# EAGLE schematic michibot (EAGLE 9.6.2)
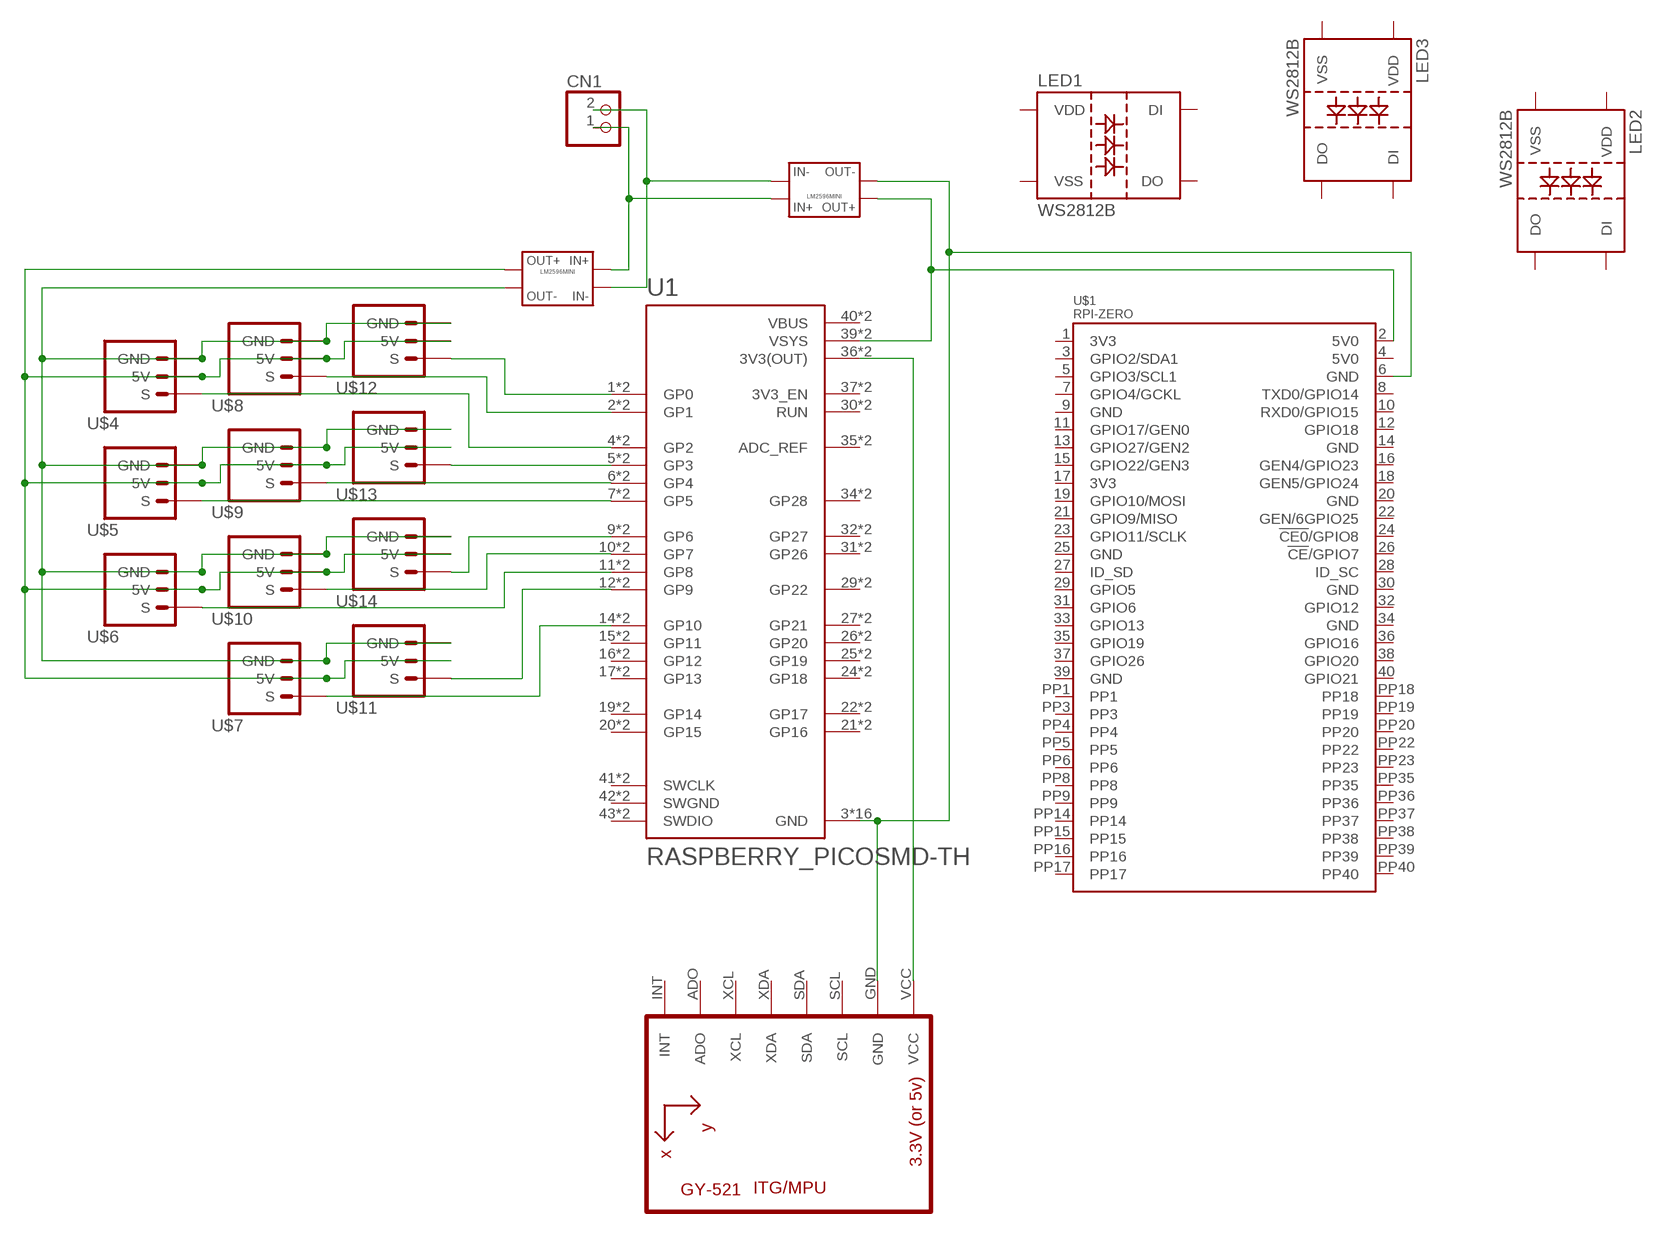
[diagram p0: schematic, sheet 1]

## Parts
CN1  JST_2PIN-THM  [JST-PH-2-THM]
LED1  WS2812B  [WS2812B]
LED2  WS2812B  [WS2812B]
LED3  WS2812B  [WS2812B]
U1  RASPBERRY_PICOSMD-TH  [PICO-PKG]
U2  GY-521MPU6050  [GY-521]
U$1  RPI-ZERO  [RASP_PI_ZERO_BOARD_FULL]
U$2  BB-LM2596MINI  [BB-LM2596MINI]
U$3  BB-LM2596MINI  [BB-LM2596MINI]
U$4  BB-PIN3  [BB-PIN3]
U$5  BB-PIN3  [BB-PIN3]
U$6  BB-PIN3  [BB-PIN3]
U$7  BB-PIN3  [BB-PIN3]
U$8  BB-PIN3  [BB-PIN3]
U$9  BB-PIN3  [BB-PIN3]
U$10  BB-PIN3  [BB-PIN3]
U$11  BB-PIN3  [BB-PIN3]
U$12  BB-PIN3  [BB-PIN3]
U$13  BB-PIN3  [BB-PIN3]
U$14  BB-PIN3  [BB-PIN3]

## Nets
5V0@1: U1.39(VSYS) U1.P$39(VSYS) U$1.2(5V0) U$2.OUT+
GND@8: U1.3(GND) U1.8(GND) U1.13(GND) U1.18(GND) U1.23(GND) U1.28(GND) U1.33(GND) U1.38(GND) U1.P$3(GND) U1.P$8(GND) U1.P$13(GND) U1.P$18(GND) U1.P$23(GND) U1.P$28(GND) U1.P$33(GND) U1.P$38(GND) U2.GND U$1.6(GND) U$2.OUT-
N$1: U1.36(3V3(OUT)) U1.P$36(3V3(OUT)) U2.VCC
N$2: U$3.OUT+ U$4.2(5V) U$5.2(5V) U$6.2(5V) U$7.2(5V) U$8.2(5V) U$9.2(5V) U$10.2(5V) U$11.2(5V) U$12.2(5V) U$13.2(5V) U$14.2(5V)
N$3: U$3.OUT- U$4.1(GND) U$5.1(GND) U$6.1(GND) U$7.1(GND) U$8.1(GND) U$9.1(GND) U$10.1(GND) U$11.1(GND) U$12.1(GND) U$13.1(GND) U$14.1(GND)
N$4: CN1.1 U$2.IN+ U$3.IN+
N$5: CN1.2 U$2.IN- U$3.IN-
N$6: U1.5(GP3) U1.P$5(GP3) U$13.3(S)
N$7: U1.1(GP0) U1.P$1(GP0) U$12.3(S)
N$8: U1.2(GP1) U1.P$2(GP1) U$8.3(S)
N$9: U1.4(GP2) U1.P$4(GP2) U$4.3(S)
N$10: U1.6(GP4) U1.P$6(GP4) U$9.3(S)
N$11: U1.7(GP5) U1.P$7(GP5) U$5.3(S)
N$12: U1.9(GP6) U1.P$9(GP6) U$14.3(S)
N$13: U1.10(GP7) U1.P$10(GP7) U$10.3(S)
N$14: U1.11(GP8) U1.P$11(GP8) U$6.3(S)
N$15: U1.12(GP9) U1.P$12(GP9) U$11.3(S)
N$16: U1.14(GP10) U1.P$14(GP10) U$7.3(S)
Unconnected: LED1.1(VDD) LED1.2(DO) LED1.3(VSS) LED1.4(DI) LED2.1(VDD) LED2.2(DO) LED2.3(VSS) LED2.4(DI) LED3.1(VDD) LED3.2(DO) LED3.3(VSS) LED3.4(DI) U1.15(GP11) U1.16(GP12) U1.17(GP13) U1.19(GP14) U1.20(GP15) U1.21(GP16) U1.22(GP17) U1.24(GP18) U1.25(GP19) U1.26(GP20) U1.27(GP21) U1.29(GP22) U1.30(RUN) U1.31(GP26) U1.32(GP27) U1.34(GP28) U1.35(ADC_REF) U1.37(3V3_EN) U1.41(SWCLK) U1.43(SWDIO) U1.P$15(GP11) U1.P$16(GP12) U1.P$17(GP13) U1.P$19(GP14) U1.P$20(GP15) U1.P$21(GP16) U1.P$22(GP17) U1.P$24(GP18) U1.P$25(GP19) U1.P$26(GP20) U1.P$27(GP21) U1.P$29(GP22) U1.P$30(RUN) U1.P$31(GP26) U1.P$32(GP27) U1.P$34(GP28) U1.P$35(ADC_REF) U1.P$37(3V3_EN) U1.P$41(SWCLK) U1.P$43(SWDIO) U2.ADO U2.INT U2.SCL U2.SDA U2.XCL U2.XDA U$1.1(3V3) U$1.3(GPIO2/SDA1) U$1.4(5V0) U$1.5(GPIO3/SCL1) U$1.7(GPIO4/GCKL) U$1.8(TXD0/GPIO14) U$1.9(GND) U$1.10(RXD0/GPIO15) U$1.11(GPIO17/GEN0) U$1.12(GPIO18) U$1.13(GPIO27/GEN2) U$1.14(GND) U$1.15(GPIO22/GEN3) U$1.16(GEN4/GPIO23) U$1.17(3V3) U$1.18(GEN5/GPIO24) U$1.19(GPIO10/MOSI) U$1.20(GND) U$1.21(GPIO9/MISO) U$1.22(GEN/6GPIO25) U$1.23(GPIO11/SCLK) U$1.24(!CE0!/GPIO8) U$1.25(GND) U$1.26(!CE!/GPIO7) U$1.27(ID_SD) U$1.28(ID_SC) U$1.29(GPIO5) U$1.30(GND) U$1.31(GPIO6) U$1.32(GPIO12) U$1.33(GPIO13) U$1.34(GND) U$1.35(GPIO19) U$1.36(GPIO16) U$1.37(GPIO26) U$1.38(GPIO20) U$1.39(GND) U$1.40(GPIO21) U$1.PP1 U$1.PP3 U$1.PP4 U$1.PP5 U$1.PP6 U$1.PP8 U$1.PP9 U$1.PP14 U$1.PP15 U$1.PP16 U$1.PP17 U$1.PP18 U$1.PP19 U$1.PP20 U$1.PP22 U$1.PP23 U$1.PP35 U$1.PP36 U$1.PP37 U$1.PP38 U$1.PP39 U$1.PP40

## Power pins joined to a net without a drawn wire
SWGND: U1.42(SWGND) U1.P$42(SWGND)
VBUS: U1.40(VBUS) U1.P$40(VBUS)

## Library data of the parts
CN1 = adafruit:JST_2PIN: JST 2-Pin Connectors of various flavors SMT-RA (S2B-PH-SM4) 4UConnector #17311 SMT (B2B-PH-SM4) THM-RA (S2B-PH) THM (B2B-PH)
LED1-LED3 = LEDWS2812:WS2812B
U1 = rpiPico:RASPBERRY_PICO: Raspberry Pi Pico
U2 = mpu6050:GY-521
U$1 = rpiZero:RPI-ZERO
U$2 U$3 = my-library:BB-LM2596MINI
U$4-U$14 = my-library:BB-PIN3